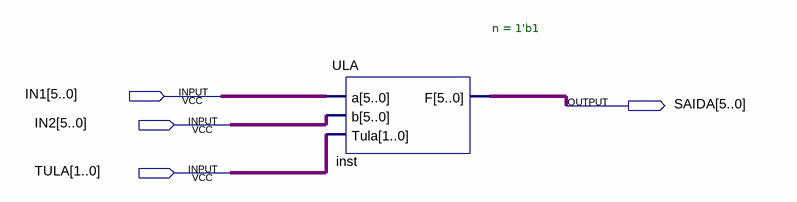
[diagram p0: schematic sheet]
// Quartus schematic testeULA.bdf as structural Verilog: 1 symbols, 4 pins
module testeULA (
  input  [5:0] IN1,
  input  [5:0] IN2,
  input  [1:0] TULA,
  output [5:0] SAIDA
);

  ULA #(.n(1'b1)) inst (.a(IN1), .b(IN2), .Tula(TULA), .F(SAIDA));
endmodule
